# EAGLE design KGGR_M4 (EAGLE 9.4.2)
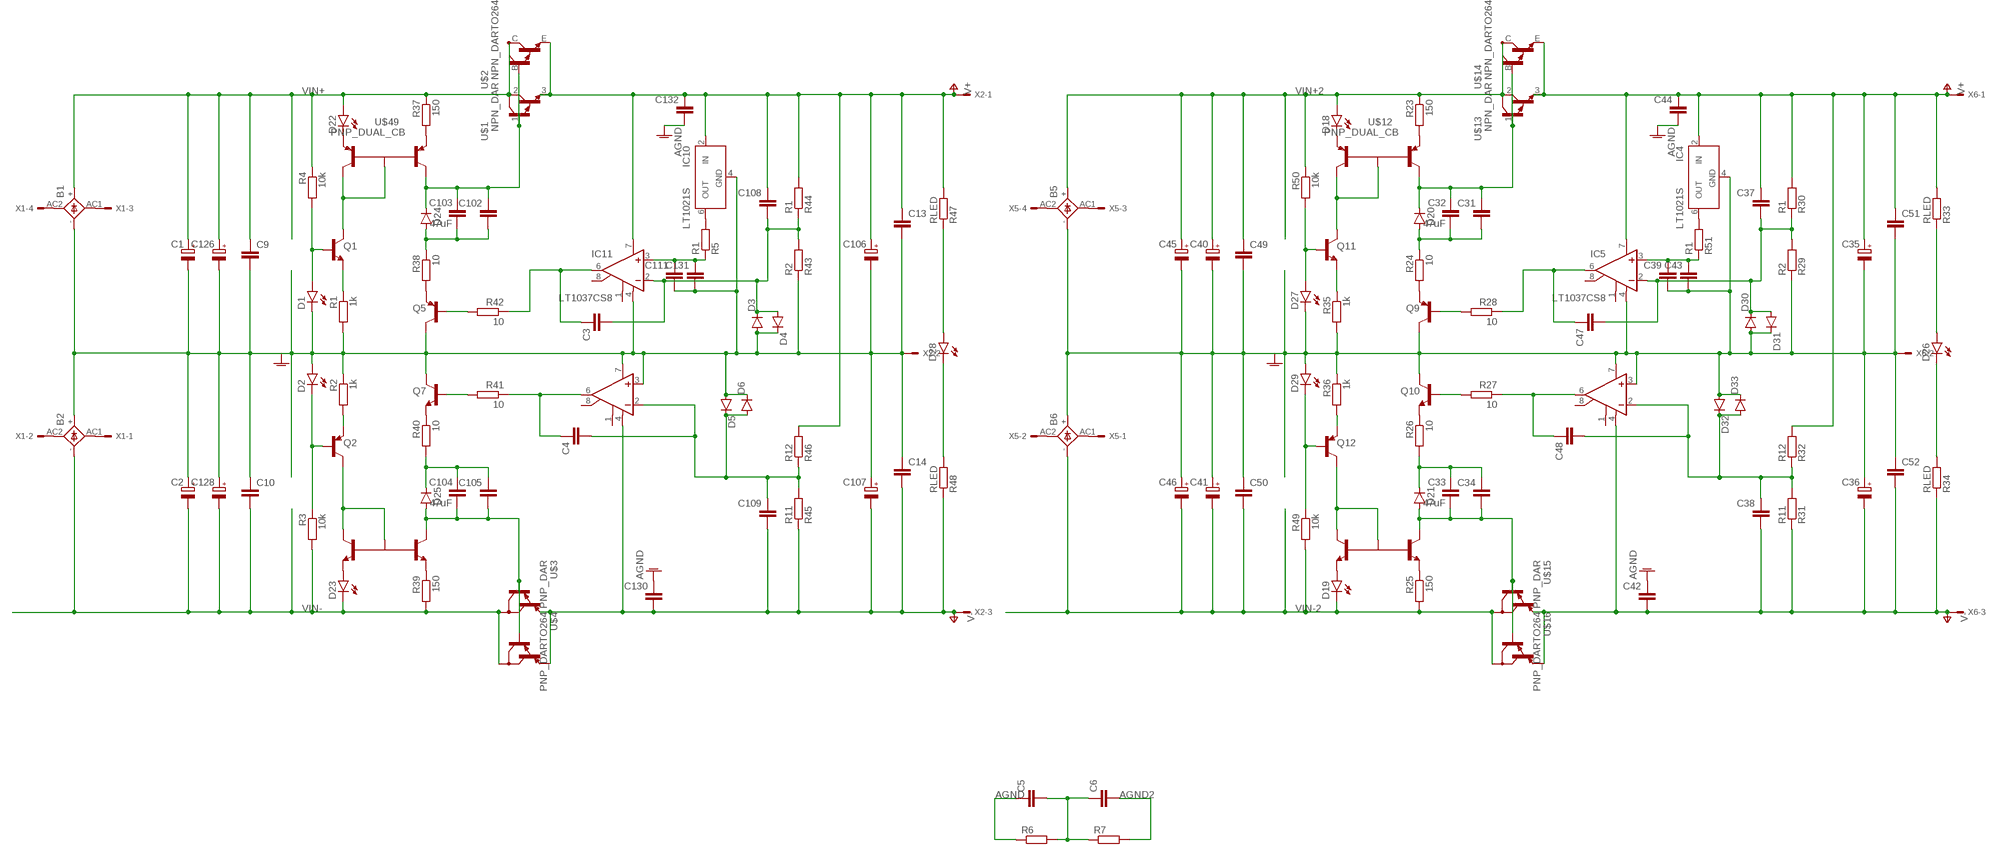
[diagram p0: schematic, sheet 1]

## Parts
B1  GBU4  [GBU4S]
B2  GBU4  [GBU4S]
B5  GBU4  [GBU4S]
B6  GBU4  [GBU4S]
C1  CPOL-EUE7.5-18  [E7,5-18]
C2  CPOL-EUE7.5-18  [E7,5-18]
C3  C-EUC0805  [C0805]
C4  C-EUC0805  [C0805]
C5  C-EU075-042X103  [C075-042X103]
C6  C-EU075-042X103  [C075-042X103]
C9  C-EU050-050X075  [C050-050X075]
C10  C-EU050-050X075  [C050-050X075]
C13  C-EU050-050X075  [C050-050X075]
C14  C-EU050-050X075  [C050-050X075]
C31  C-EUC0805  [C0805]
C32  47uF  C-EUC1206  [C1206]
C33  47uF  C-EUC1206  [C1206]
C34  C-EUC0805  [C0805]
C35  CPOL-EUE5-10.5  [E5-10,5]
C36  CPOL-EUE5-10.5  [E5-10,5]
C37  C-EUC0805  [C0805]
C38  C-EUC0805  [C0805]
C39  C-EUC0805  [C0805]
C40  CPOL-EUE7.5-18  [E7,5-18]
C41  CPOL-EUE7.5-18  [E7,5-18]
C42  C-EUC0805  [C0805]
C43  C-EUC1206  [C1206]
C44  C-EUC0805  [C0805]
C45  CPOL-EUE7.5-18  [E7,5-18]
C46  CPOL-EUE7.5-18  [E7,5-18]
C47  C-EUC0805  [C0805]
C48  C-EUC0805  [C0805]
C49  C-EU050-050X075  [C050-050X075]
C50  C-EU050-050X075  [C050-050X075]
C51  C-EU050-050X075  [C050-050X075]
C52  C-EU050-050X075  [C050-050X075]
C102  C-EUC0805  [C0805]
C103  47uF  C-EUC1206  [C1206]
C104  47uF  C-EUC1206  [C1206]
C105  C-EUC0805  [C0805]
C106  CPOL-EUE5-10.5  [E5-10,5]
C107  CPOL-EUE5-10.5  [E5-10,5]
C108  C-EUC0805  [C0805]
C109  C-EUC0805  [C0805]
C111  C-EUC0805  [C0805]
C126  CPOL-EUE7.5-18  [E7,5-18]
C128  CPOL-EUE7.5-18  [E7,5-18]
C130  C-EUC0805  [C0805]
C131  C-EUC1206  [C1206]
C132  C-EUC0805  [C0805]
D1  LEDVWV1206  [LED_SML1206]
D2  LEDVWV1206  [LED_SML1206]
D3  DIODE-SOD80C  [SOD80C]
D4  DIODE-SOD80C  [SOD80C]
D5  DIODE-SOD80C  [SOD80C]
D6  DIODE-SOD80C  [SOD80C]
D18  LEDVWV1206  [LED_SML1206]
D19  LEDVWV1206  [LED_SML1206]
D20  TZMC10  DIODE-SOD80C  [SOD80C]
D21  TZAMC10  DIODE-SOD80C  [SOD80C]
D22  LEDVWV1206  [LED_SML1206]
D23  LEDVWV1206  [LED_SML1206]
D24  TZMC10  DIODE-SOD80C  [SOD80C]
D25  TZAMC10  DIODE-SOD80C  [SOD80C]
D26  LEDVWV1206  [LED_SML1206]
D27  LEDVWV1206  [LED_SML1206]
D28  LEDVWV1206  [LED_SML1206]
D29  LEDVWV1206  [LED_SML1206]
D30  DIODE-SOD80C  [SOD80C]
D31  DIODE-SOD80C  [SOD80C]
D32  DIODE-SOD80C  [SOD80C]
D33  DIODE-SOD80C  [SOD80C]
IC4  LT1021S  [SOIC8]
IC5  LT1037CS8  [SOIC8]
IC6  LT1037CS8  [SOIC8]
IC10  LT1021S  [SOIC8]
IC11  LT1037CS8  [SOIC8]
IC12  LT1037CS8  [SOIC8]
Q1  TRANSISTOR_BC847CLT1-NPN-SOT23-BEC  [TRANSISTOR_SOT23-BEC]
Q2  TRANSISTOR_BC857C-PNP-SOT23-BEC  [TRANSISTOR_SOT23-BEC]
Q5  TRANSISTOR_BC857C-PNP-SOT23-BEC  [TRANSISTOR_SOT23-BEC]
Q7  TRANSISTOR_BC847CLT1-NPN-SOT23-BEC  [TRANSISTOR_SOT23-BEC]
Q9  TRANSISTOR_BC857C-PNP-SOT23-BEC  [TRANSISTOR_SOT23-BEC]
Q10  TRANSISTOR_BC847CLT1-NPN-SOT23-BEC  [TRANSISTOR_SOT23-BEC]
Q11  TRANSISTOR_BC847CLT1-NPN-SOT23-BEC  [TRANSISTOR_SOT23-BEC]
Q12  TRANSISTOR_BC857C-PNP-SOT23-BEC  [TRANSISTOR_SOT23-BEC]
R1  1k  R-EU_MELF0204W  [MINI_MELF-0204W]
R2  1k  R-EU_MELF0204W  [MINI_MELF-0204W]
R3  10k  R-EU_MELF0204W  [MINI_MELF-0204W]
R4  10k  R-EU_MELF0204W  [MINI_MELF-0204W]
R5  R1  R-EU_MELF0204W  [MINI_MELF-0204W]
R6  R-EU_R2512  [R2512]
R7  R-EU_R2512  [R2512]
R23  150  R-EU_MELF0204W  [MINI_MELF-0204W]
R24  10  R-EU_MELF0204W  [MINI_MELF-0204W]
R25  150  R-EU_MELF0204W  [MINI_MELF-0204W]
R26  10  R-EU_MELF0204W  [MINI_MELF-0204W]
R27  10  R-EU_MELF0204W  [MINI_MELF-0204W]
R28  10  R-EU_MELF0204W  [MINI_MELF-0204W]
R29  R2  R-EU_MELF0204W  [MINI_MELF-0204W]
R30  R1  R-EU_MELF0204W  [MINI_MELF-0204W]
R31  R11  R-EU_MELF0204W  [MINI_MELF-0204W]
R32  R12  R-EU_MELF0204W  [MINI_MELF-0204W]
R33  RLED  R-EU_MELF0204W  [MINI_MELF-0204W]
R34  RLED  R-EU_MELF0204W  [MINI_MELF-0204W]
R35  1k  R-EU_MELF0204W  [MINI_MELF-0204W]
R36  1k  R-EU_MELF0204W  [MINI_MELF-0204W]
R37  150  R-EU_MELF0204W  [MINI_MELF-0204W]
R38  10  R-EU_MELF0204W  [MINI_MELF-0204W]
R39  150  R-EU_MELF0204W  [MINI_MELF-0204W]
R40  10  R-EU_MELF0204W  [MINI_MELF-0204W]
R41  10  R-EU_MELF0204W  [MINI_MELF-0204W]
R42  10  R-EU_MELF0204W  [MINI_MELF-0204W]
R43  R2  R-EU_MELF0204W  [MINI_MELF-0204W]
R44  R1  R-EU_MELF0204W  [MINI_MELF-0204W]
R45  R11  R-EU_MELF0204W  [MINI_MELF-0204W]
R46  R12  R-EU_MELF0204W  [MINI_MELF-0204W]
R47  RLED  R-EU_MELF0204W  [MINI_MELF-0204W]
R48  RLED  R-EU_MELF0204W  [MINI_MELF-0204W]
R49  10k  R-EU_MELF0204W  [MINI_MELF-0204W]
R50  10k  R-EU_MELF0204W  [MINI_MELF-0204W]
R51  R1  R-EU_MELF0204W  [MINI_MELF-0204W]
U$1  NPN_DAR  [TRANSISTOR_TO220KG]
U$2  NPN_DARTO264  [TO264_TO-264]
U$3  PNP_DAR  [TRANSISTOR_TO220KG]
U$4  PNP_DARTO264  [TO264_TO-264]
U$11  NPN_DUAL_CBSOT-25-5  [SOT25]
U$12  PNP_DUAL_CB  [SOT25]
U$13  NPN_DAR  [TRANSISTOR_TO220KG]
U$14  NPN_DARTO264  [TO264_TO-264]
U$15  PNP_DAR  [TRANSISTOR_TO220KG]
U$16  PNP_DARTO264  [TO264_TO-264]
U$48  NPN_DUAL_CBSOT-25-5  [SOT25]
U$49  PNP_DUAL_CB  [SOT25]
X1  KK-156-4  [KK-156-4]
X2  KK-156-3  [KK-156-3]
X5  KK-156-4  [KK-156-4]
X6  KK-156-3  [KK-156-3]

## Nets
AGND: B1.- B2.+ C1.- C2.+ C5.1 C9.2 C10.1 C13.2 C14.1 C106.- C107.+ C111.2 C126.- C128.+ C130.1 C131.2 C132.2 D1.C D2.A D3.A D4.C D5.A D6.C IC10.4(GND) IC11.4(V-) IC12.3(+IN) IC12.7(V+) Q5.C Q7.C R1.2 R2.1 R6.1 R43.1 X2.2
AGND2: B5.- B6.+ C6.2 C35.- C36.+ C39.2 C40.- C41.+ C42.1 C43.2 C44.2 C45.- C46.+ C49.2 C50.1 C51.2 C52.1 D27.C D29.A D30.A D31.C D32.A D33.C IC4.4(GND) IC5.4(V-) IC6.3(+IN) IC6.7(V+) Q9.C Q10.C R7.2 R29.1 R35.2 R36.1 X6.2 ; supply symbol labelled AGND
N$1: B1.AC2(AC1) X1.4
N$2: B1.AC1(AC2) X1.3
N$3: B2.AC2(AC1) X1.2
N$4: B2.AC1(AC2) X1.1
N$6: C5.2 C6.1 R6.2 R7.1
N$9: Q1.E R1.1
N$10: D1.A Q1.B R4.2
N$12: Q2.E R2.2
N$13: D2.C Q2.B R3.1
N$14: IC10.6(OUT) R5.2
N$50: Q11.C U$12.2(B) U$12.5(C1)
N$51: C31.1 C32.1 D20.C U$12.4(C2) U$13.1(B) U$14.B
N$52: C31.2 C32.2 D20.A R24.1
N$53: Q9.E R24.2
N$54: Q10.E R26.1
N$55: C33.1 C34.1 D21.C R26.2
N$56: C33.2 C34.2 D21.A U$11.4(C2) U$15.1(B) U$16.B
N$57: Q12.C U$11.2(B) U$11.5(C1)
N$58: Q10.B R27.2
N$59: Q9.B R28.2
N$60: C37.2 C47.2 D30.C D31.A IC5.2(-IN) R29.2 R30.1
N$61: D26.C R34.2
N$62: D26.A R33.1
N$63: C48.1 IC6.6(OUT) R27.1
N$64: C38.1 C48.2 D32.C D33.A IC6.2(-IN) R31.2 R32.1
N$65: C39.1 C43.1 IC5.3(+IN) R51.1
N$66: C47.1 IC5.6(OUT) R28.1
N$68: R25.1 U$11.3(E2)
N$69: D19.A U$11.1(E1)
N$71: R23.2 U$12.3(E2)
N$72: D18.C U$12.1(E1)
N$73: B5.AC2(AC1) X5.4
N$74: B5.AC1(AC2) X5.3
N$75: B6.AC2(AC1) X5.2
N$76: B6.AC1(AC2) X5.1
N$77: Q11.E R35.1
N$78: D27.A Q11.B R50.2
N$79: Q12.E R36.2
N$80: D29.C Q12.B R49.1
N$81: IC4.6(OUT) R51.2
N$96: Q1.C U$49.2(B) U$49.5(C1)
N$97: C102.1 C103.1 D24.C U$1.1(B) U$2.B U$49.4(C2)
N$98: C102.2 C103.2 D24.A R38.1
N$99: Q5.E R38.2
N$100: Q7.E R40.1
N$101: C104.1 C105.1 D25.C R40.2
N$102: C104.2 C105.2 D25.A U$3.1(B) U$4.B U$48.4(C2)
N$103: Q2.C U$48.2(B) U$48.5(C1)
N$104: Q7.B R41.2
N$105: Q5.B R42.2
N$106: C3.2 C108.2 D3.C D4.A IC11.2(-IN) R43.2 R44.1
N$107: D28.C R48.2
N$108: D28.A R47.1
N$109: C4.1 IC12.6(OUT) R41.1
N$110: C4.2 C109.1 D5.C D6.A IC12.2(-IN) R45.2 R46.1
N$111: C111.1 C131.1 IC11.3(+IN) R5.1
N$112: C3.1 IC11.6(OUT) R42.1
N$113: R39.1 U$48.3(E2)
N$114: D23.A U$48.1(E1)
N$115: R37.2 U$49.3(E2)
N$116: D22.C U$49.1(E1)
V+: C13.1 C106.+ C108.1 C132.1 IC10.2(IN) IC11.7(V+) R44.2 R46.2 R47.2 U$1.3(E) U$2.E X2.1
V+2: C35.+ C37.1 C44.1 C51.1 IC4.2(IN) IC5.7(V+) R30.2 R32.2 R33.2 U$13.3(E) U$14.E X6.1 ; supply symbol labelled V+
V-: C14.2 C107.- C109.2 C130.2 IC12.4(V-) R45.1 R48.1 U$3.3(E) U$4.E X2.3
V-2: C36.- C38.2 C42.2 C52.2 IC6.4(V-) R31.1 R34.1 U$15.3(E) U$16.E X6.3 ; supply symbol labelled V-
VIN+: B1.+ C1.+ C9.1 C126.+ D22.A R4.1 R37.1 U$1.2(C) U$2.C
VIN+2: B5.+ C40.+ C45.+ C49.1 D18.A R23.1 R50.1 U$13.2(C) U$14.C
VIN-: B2.- C2.- C10.2 C128.- D23.C R3.2 R39.2 U$3.2(C) U$4.C
VIN-2: B6.- C41.- C46.- C50.2 D19.C R25.2 R49.2 U$15.2(C) U$16.C
Unconnected: IC5.1(CMP1) IC5.8(CMP2) IC6.1(CMP1) IC6.8(CMP2) IC11.1(CMP1) IC11.8(CMP2) IC12.1(CMP1) IC12.8(CMP2)

## Library data of the parts
B1 B2 B5 B6 = Vwvwbg:GBU4: GENERAL INSTRUMENT RECTIFIER
C1 C2 C35 C36 C40 C41 C45 C46 C106 C107 C126 C128 = Vwvwbg:CPOL-EU: POLARIZED CAPACITOR, European symbol
C3-C6 C9 C10 C13 C14 C31-C34 C37-C39 C42-C44 C47-C52 C102-C105 C108 C109 C111 C130-C132 = Vwvwbg:C-EU: CAPACITOR, European symbol
D1 D2 D18 D19 D22 D23 D26-D29 = Vwvwbg:LED: LED OSRAM: - CHIPLED LG R971, LG N971, LY N971, LG Q971, LY Q971, LO R971, LY R971 LH N974, LH R974 LS Q976, LO Q976, LY Q976 LO Q996 - Hyper CHIPLED LW Q18S LB Q993, LB Q99A, LB R99A - SideLED LS A670, LO A670, LY A670, LG A670, LP A670 LB A673, LV A673, LT A673, LW A673 LH A674 LY A675 LS A676, LA A676, LO A676, LY A676, LW A676 LS A679, LY A679, LG A679 - Hyper Micro SIDELED® LS Y876, LA Y876, LO Y876, LY Y876 LT Y87S - SmartLED LW L88C, LW L88S LB L89C, LB L89S, LG L890 LS L89K, LO L89K, LY L89K LS L896, LA L896, LO L896, LY L896 - TOPLED LS T670, LO T670, LY T670, LG T670, LP T670 LSG T670, LSP T670, LSY T670, LOP T670, LYG T670 LG T671, LOG T671, LSG T671 LB T673, LV T673, LT T673, LW T673 LH T674 LS T676, LA T676, LO T676, LY T676, LB T676, LH T676, LSB T676, LW T676 LB T67C, LV T67C, LT T67C, LS T67K, LO T67K, LY T67K, LW E67C LS E67B, LA E67B, LO E67B, LY E67B, LB E67C, LV E67C, LT E67C LW T67C LS T679, LY T679, LG T679 LS T770, LO T770, LY T770, LG T770, LP T770 LB T773, LV T773, LT T773, LW T773 LH T774 LS E675, LA E675, LY E675, LS T675 LS T776, LA T776, LO T776, LY T776, LB T776 LHGB T686 LT T68C, LB T68C - Hyper Mini TOPLED® LB M676 - Mini TOPLED Santana® LG M470 LS M47K, LO M47K, LY M47K Source: http://www.osram.convergy.de LUXEON: - LUMILED® LXK2-PW12-R00, LXK2-PW12-S00, LXK2-PW14-U00, LXK2-PW14-V00 LXK2-PM12-R00, LXK2-PM12-S00, LXK2-PM14-U00 LXK2-PE12-Q00, LXK2-PE12-R00, LXK2-PE12-S00, LXK2-PE14-T00, LXK2-PE14-U00 LXK2-PB12-K00, LXK2-PB12-L00, LXK2-PB12-M00, LXK2-PB14-N00, LXK2-PB14-P00, LXK2-PB14-Q00 LXK2-PR12-L00, LXK2-PR12-M00, LXK2-PR14-Q00, LXK2-PR14-R00 LXK2-PD12-Q00, LXK2-PD12-R00, LXK2-PD12-S00 LXK2-PH12-R00, LXK2-PH12-S00 LXK2-PL12-P00, LXK2-PL12-Q00, LXK2-PL12-R00 Source: www.luxeon.com KINGBRIGHT: KA-3528ASYC Source: www.kingbright.com
D3-D6 D20 D21 D24 D25 D30-D33 = Vwvwbg:DIODE-: DIODE
IC4 IC10 = Vwvwbg:LT1021: Precision Reference Source: http://www.linear.com/pc/downloadDocument.do?navId=H0,C1,C1010,C1603,P1229,D2805; MPN: LT1021DCS8-10#PBF; OC_FARNELL: 1273428; OC_NEWARK: 57M0993
IC5 IC6 IC11 IC12 = Vwvwbg:LT10*: Low Noise, High Speed, Precision Operational Amplifiers Source: http://www.linear.com/pc/downloadDocument.do?navId=H0,C1,C1154,C1009,C1026,P1212,D2204
Q1 Q7 Q10 Q11 = Vwvwbg:TRANSISTOR_*-NPN-: NPN Transistror BF959 corrected 2008.03.06
Q2 Q5 Q9 Q12 = Vwvwbg:TRANSISTOR_*-PNP-: PNP Transistror
R1-R7 R23-R51 = Vwvwbg:R-EU_: RESISTOR, European symbol
U$1 U$2 U$13 U$14 = Vwvwbg:NPN_DAR
U$3 U$4 U$15 U$16 = Vwvwbg:PNP_DAR
U$11 U$48 = Vwvwbg:NPN_DUAL_CB
U$12 U$49 = Vwvwbg:PNP_DUAL_CB
X1 X5 = Vwvwbg:KK-156-4: KK 156 HEADER Source: http://www.molex.com/pdm_docs/sd/026604100_sd.pdf; MF: MOLEX; OC_FARNELL: unknown; OC_NEWARK: unknown
X2 X6 = Vwvwbg:KK-156-3: KK 156 HEADER Source: http://www.molex.com/pdm_docs/sd/026604100_sd.pdf; MF: MOLEX; OC_FARNELL: unknown; OC_NEWARK: unknown

## Board
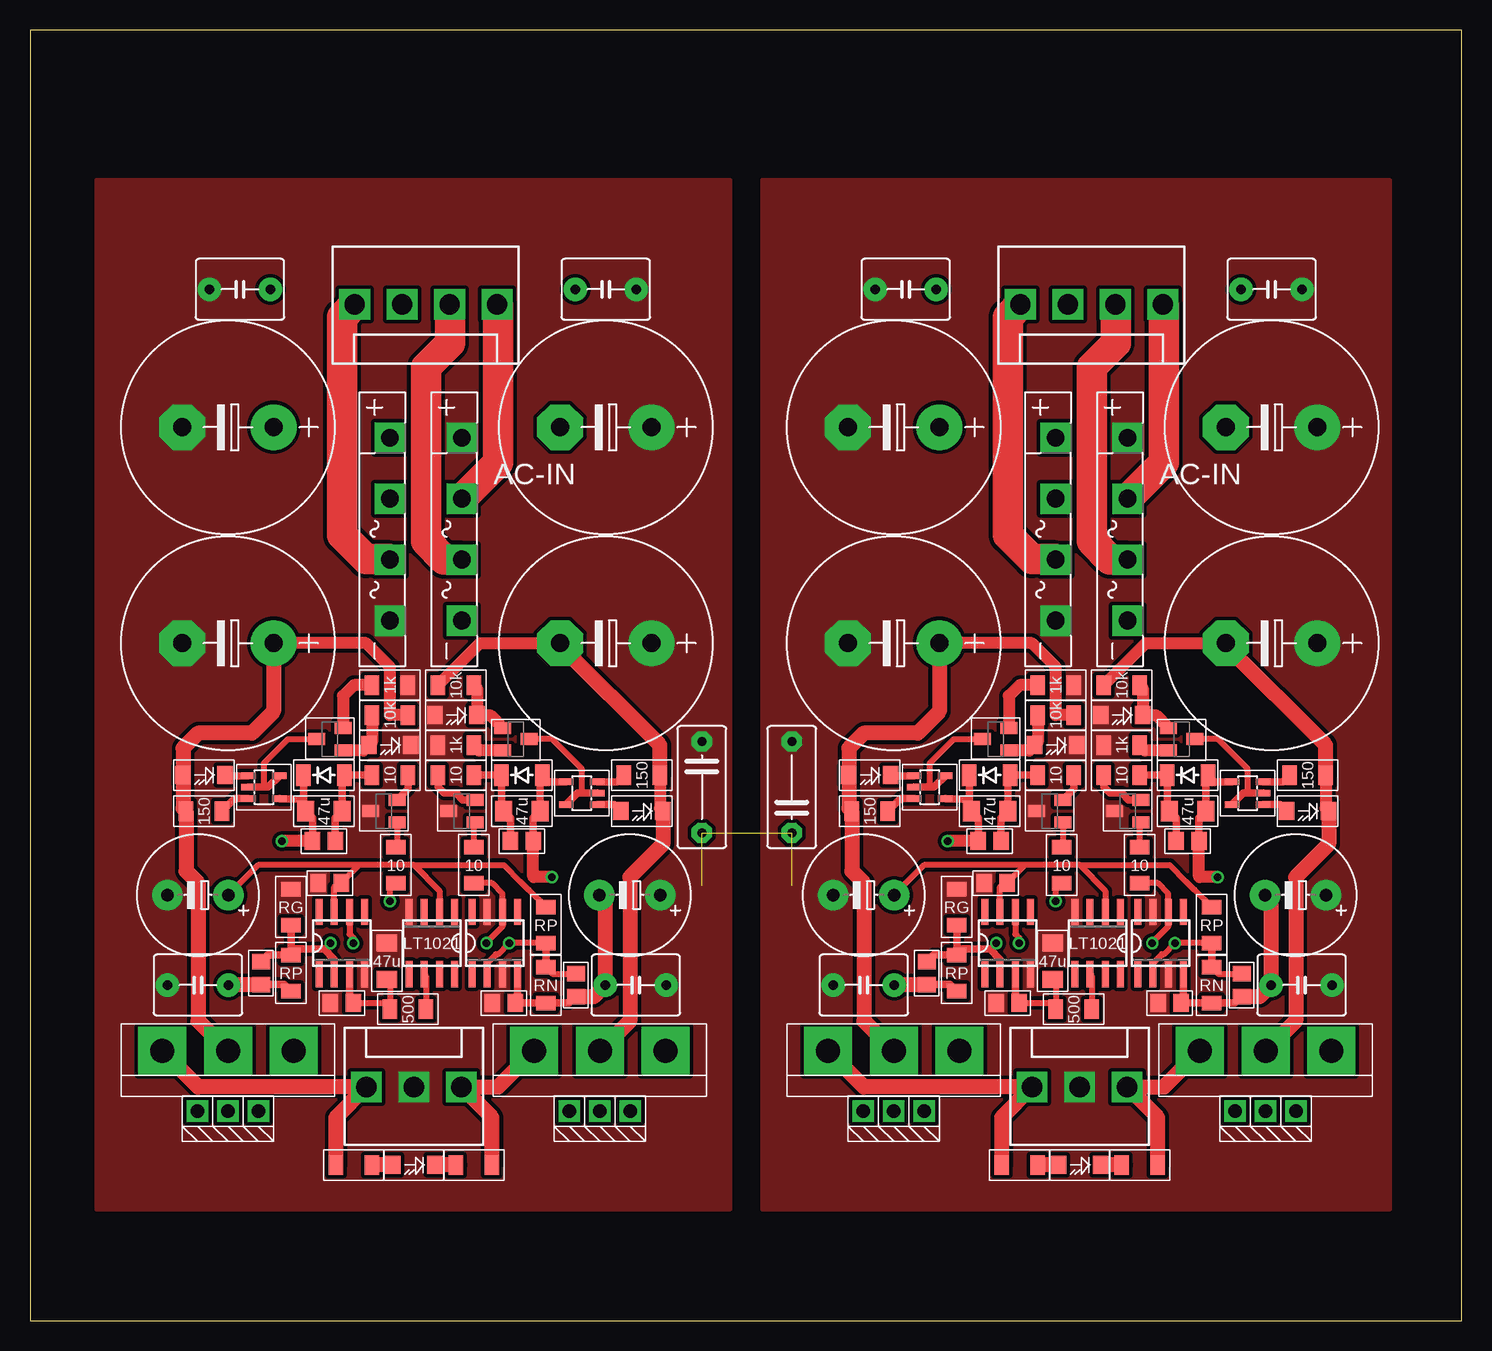
[diagram p1: board, top side]
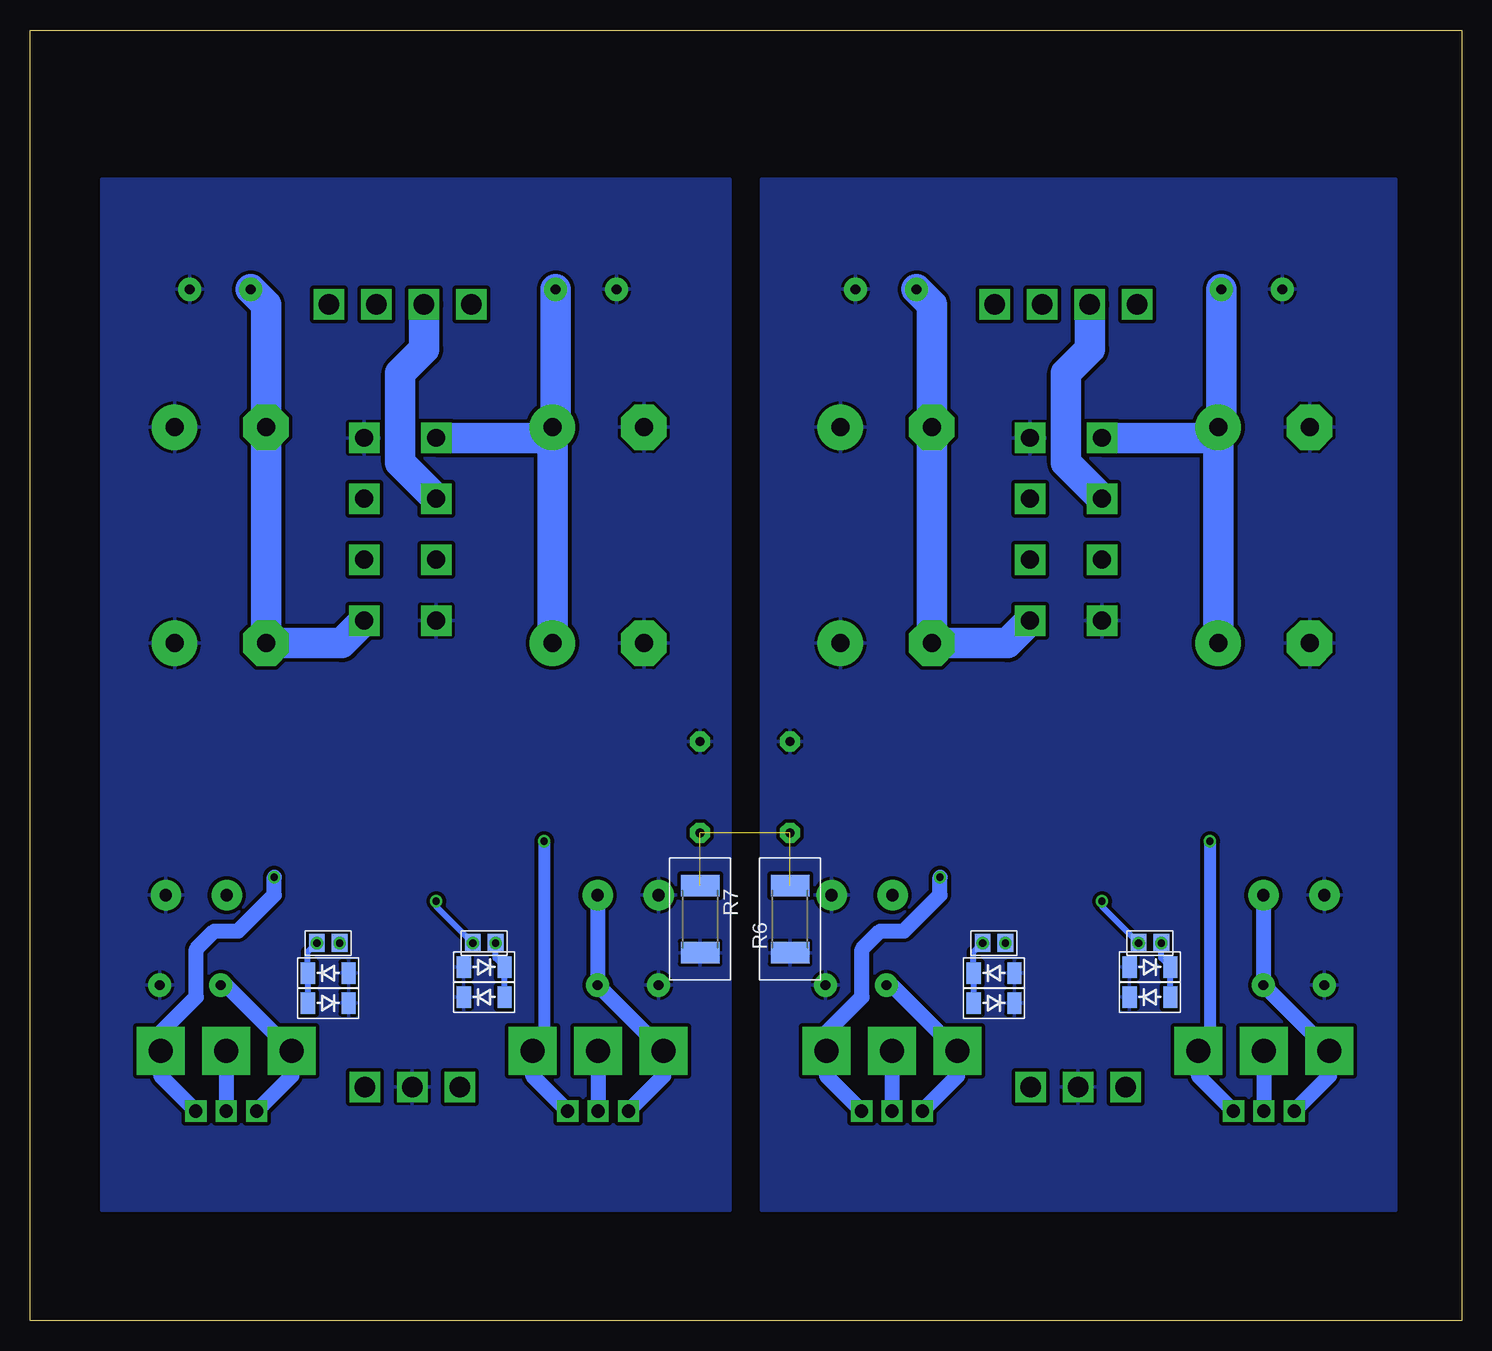
[diagram p2: board, bottom side, seen from below]

Size 119.36 x 107.62 mm. Coordinates in mm from the lower left corner, seen from the top.
Outline: 0,0 119.36,0 119.36,107.62 0,107.62 0,0
Copper layers (1*16): Top 0.035mm / dielectric 1.5mm / Bottom 0.035mm
Design rules "default *": minimum track width 10mil, minimum drill 24mil, track to track 12mil, track to pad 12mil, pad to pad 8mil, via to via 8mil, smd to smd 8mil, copper to edge 20mil, drill to drill 8mil, minimum pad ring 10mil, minimum via ring 8mil, stop-mask expansion 4mil, vias tented up to drill 0mil, thermal gap 10mil

### Footprints (pad centres in the part's own frame; a part is rotated, then mirrored left to right if it is on the bottom)
GBU4S = drill 1.499 pad 2.54 square: + 7.62,0; - -7.62,0; AC1 2.54,0; AC2 -2.54,0
E7,5-18 = drill 1.5 pad 3.81: + -3.81,0 | drill 1.5 pad 3.81 octagon: - 3.81,0
C0805 = smd 1.3 x 1.5: 1 -0.95,0; 2 0.95,0
C075-042X103 = drill 0.75 pad 1.676 octagon: 1 -3.81,0; 2 3.81,0
C050-050X075 = drill 0.813 pad 1.93: 1 -2.54,0; 2 2.54,0
C1206 = smd 1.4 x 1.7: 1 -1.527,0; 2 1.527,0
E5-10,5 = drill 1.016 pad 2.54: + -2.54,0; - 2.54,0
LED_SML1206 = smd 1.3 x 1.5: A 1.75,0; C -1.75,0
SOD80C = smd 1.2 x 1.8: A 1.7,0; C -1.7,0
SOIC8 = smd 0.6 x 2.2: 1 -1.905,-2.6; 2 -0.635,-2.6; 3 0.635,-2.6; 4 1.905,-2.6; 5 1.905,2.6; 6 0.635,2.6; 7 -0.635,2.6; 8 -1.905,2.6
TRANSISTOR_SOT23-BEC = smd 1 x 1.4: B -0.95,-1.1; C 0,1.1; E 0.95,-1.1
MINI_MELF-0204W = smd 1.2 x 1.6: 1 -1.5,0; 2 1.5,0
R2512 = smd 1.8 x 3.2: 1 -2.8,0; 2 2.8,0
TRANSISTOR_TO220KG = drill 1.1 pad 1.778 square: 1 -2.54,0; 2 0,0; 3 2.54,0
TO264_TO-264 = drill 2 pad 4 square: B -5.461,0; C 0,0; E 5.461,0
SOT25 = smd 0.55 x 1.2: 1 -0.95,-1.3; 2 0,-1.3; 3 0.95,-1.3; 4 0.95,1.3; 5 -0.95,1.3
KK-156-4 = drill 1.7 pad 2.54 square: 1 -5.94,0; 2 -1.98,0; 3 1.98,0; 4 5.94,0
KK-156-3 = drill 1.7 pad 2.54 square: 1 -3.96,0; 2 0,0; 3 3.96,0

### Placement (x,y rotation side)
B1  30,66 90 top
B2  36,66 90 top
B5  85.5,66 90 top
B6  91.5,66 90 top
C1  16.5,56.5 180 top
C2  48,56.5 180 top
C3  26,31.5 0 bottom
C4  39,31.5 180 bottom
C5  56,44.5 270 top
C6  63.5,44.5 90 top
C9  17.5,86 180 top
C10  48,86 180 top
C13  14,28 180 top
C14  50.5,28 180 top
C31  80,40 0 top
C32  80,42.5 0 top
C33  96.5,42.5 0 top
C34  96.5,40 0 top
C35  69.5,35.5 180 top
C36  105.5,35.5 180 top
C37  74.75,29 90 top
C38  101,28 270 top
C39  81.5,26.5 180 top
C40  72,74.5 180 top
C41  103.5,74.5 180 top
C42  95,26.5 0 top
C43  85.25,30 90 top
C44  80.5,36.5 180 top
C45  72,56.5 180 top
C46  103.5,56.5 180 top
C47  81.5,31.5 0 bottom
C48  94.5,31.5 180 bottom
C49  73,86 180 top
C50  103.5,86 180 top
C51  69.5,28 180 top
C52  106,28 180 top
C102  24.5,40 0 top
C103  24.5,42.5 0 top
C104  41,42.5 0 top
C105  41,40 0 top
C106  14,35.5 180 top
C107  50,35.5 180 top
C108  19.25,29 90 top
C109  45.5,28 270 top
C111  26,26.5 180 top
C126  16.5,74.5 180 top
C128  48,74.5 180 top
C130  39.5,26.5 0 top
C131  29.75,30 90 top
C132  25,36.5 180 top
D1  30,48 180 top
D2  35.5,50.5 180 top
D3  26,29.5 180 bottom
D4  26,27 0 bottom
D5  39,29 0 bottom
D6  39,26.5 180 bottom
D18  70,45.5 180 top
D19  106.5,42.5 180 top
D20  80,45.5 0 top
D21  96.5,45.5 0 top
D22  14.5,45.5 180 top
D23  51,42.5 180 top
D24  24.5,45.5 0 top
D25  41,45.5 0 top
D26  87.5,13 180 top
D27  85.5,48 180 top
D28  32,13 180 top
D29  91,50.5 180 top
D30  81.5,29.5 180 bottom
D31  81.5,27 0 bottom
D32  94.5,29 0 bottom
D33  94.5,26.5 180 bottom
IC4  89,31.5 180 top
IC5  81.5,31.5 0 top
IC6  94.25,31.5 0 top
IC10  33.5,31.5 180 top
IC11  26,31.5 0 top
IC12  38.75,31.5 0 top
Q1  25,48.5 90 top
Q2  40.5,48.5 270 top
Q5  29.5,42.5 90 top
Q7  36,42.5 90 top
Q9  85,42.5 90 top
Q10  91.5,42.5 90 top
Q11  80.5,48.5 90 top
Q12  96,48.5 270 top
R1  30,53 0 top
R2  35.5,48 0 top
R3  35.5,53 180 top
R4  30,50.5 180 top
R5  31.5,26 0 top
R6  56,33.5 90 bottom
R7  63.5,33.5 270 bottom
R23  70,42.5 0 top
R24  85.5,45.5 0 top
R25  106.5,45.5 0 top
R26  91,45.5 0 top
R27  92.5,38 90 top
R28  86,38 90 top
R29  77.25,34.5 270 top
R30  77.25,29 270 top
R31  98.5,28 90 top
R32  98.5,33 90 top
R33  82.5,13 180 top
R34  92.5,13 180 top
R35  85.5,53 0 top
R36  91,48 0 top
R37  14.5,42.5 0 top
R38  30,45.5 0 top
R39  51,45.5 0 top
R40  35.5,45.5 0 top
R41  37,38 90 top
R42  30.5,38 90 top
R43  21.75,34.5 270 top
R44  21.75,29 270 top
R45  43,28 90 top
R46  43,33 90 top
R47  27,13 180 top
R48  37,13 180 top
R49  91,53 180 top
R50  85.5,50.5 180 top
R51  87,26 0 top
U$1  16.5,17.5 180 top
U$2  16.5,22.5 180 top
U$3  47.5,17.5 180 top
U$4  47.5,22.5 180 top
U$11  101.5,44 90 top
U$12  75,44.5 270 top
U$13  72,17.5 180 top
U$14  72,22.5 180 top
U$15  103,17.5 180 top
U$16  103,22.5 180 top
U$48  46,44 90 top
U$49  19.5,44.5 270 top
X1  33,84.75 180 top
X2  32,19.5 0 top
X5  88.5,84.75 180 top
X6  87.5,19.5 0 top

### Tracks (layer width: path | path; a pad name or v marks a point on that pad's centre or on a via)
AGND
  pour Top (no thermals): 5.5,95.18 58.38,95.18 58.38,9.23 5.5,9.23
  pour Bottom: 5.5,9.23 5.5,95.18 58.38,95.18 58.38,9.23
AGND2
  pour Top (no thermals): 61,95.18 113.38,95.18 113.38,9.23 61,9.23
  pour Bottom: 61,9.23 61,95.18 113.38,95.18 113.38,9.23
N$1
  Top 2.54: B1.AC2 29.96,63.5 28,63.5 26,65.5 26,83.69 X1.4
N$2
  Bottom 2.54: B1.AC1 33,71.54 33,79 31,81 31,84.73 X1.3
N$3
  Top 2.54: B2.AC2 34.54,63.46 33,65 33,79.5 35,81.5 35,84.73 X1.2
N$4
  Top 2.54: B2.AC1 39,71.54 39,84.69 X1.1
N$6  (3 unrouted)
N$9
  Top 1.016: R1.1 27,53 26.1,52.1 Q1.E
N$10
  Top 1.016: R4.2 28.5,48.25 D1.A 27.8,47.55 Q1.B
N$12
  Top 1.016: Q2.E 37.45,47.55 R2.2
N$13
  Top 1.016: R3.1 37.25,52.75 D2.C 38.35,50.5 Q2.B
N$14
  Top 0.508: IC10.6 33,28.77 R5.2
N$50
  Top 0.508: 75,44.5 75,46.5 77,48.5 Q11.C
  Top 0.61: U$12.5 75.35,44.5 75,44.5 U$12.2
N$51  (via drill 0.61)
  Top 0.61: C31.1 79.05,41.92 C32.1 78.3,42.67 78.3,43.5 | D20.C 78.3,43.5 | U$12.4 76.35,43.5 78.3,43.5
  Top 1.016: C31.1 v76.5,40
  Bottom 1.016: v76.5,40 76.5,23.46 U$14.B
  Bottom 1.27: U$13.1 77.46,20.42 U$14.B
N$52
  Top 0.61: R24.1 D20.A 81.53,45.33 C32.2 80.95,41.92 C31.2
N$53
  Top 0.61: R24.2 87,44.35 Q9.E
N$54
  Top 0.61: Q10.E 91.55,43.45 91,44 90,44 89.5,44.5 R26.1
N$55
  Top 0.61: R26.2 D21.C 94.8,42.67 C33.1 95.55,41.92 C34.1
N$56  (via drill 0.61)
  Top 0.61: C34.2 97.45,41.92 C33.2 98.03,45.33 D21.A 98.75,44.95 U$11.4
  Top 1.016: v99,37 97.5,37 97.45,37.05 C34.2
  Bottom 1.27: U$15.1 108.46,20.42 U$16.B 108.46,24.04 105.5,27 105.5,31 104,32.5 102,32.5 99,35.5 v99,37
N$57
  Top 0.508: 101.5,44 101.5,46 99,48.5 Q12.C
  Top 0.61: U$11.5 101.15,44 101.5,44 U$11.2
N$58
  Top 0.508: R27.2 92.5,41.45 Q10.B
N$59
  Top 0.508: Q9.B 86.1,39.6 R28.2
N$60  (via drill 0.61)
  Top 0.508: C47.2 80.05,31 80,31
  Top 0.61: 77.25,31 R30.1 75.3,30.5 C37.2 | 77.25,31 R29.2 | IC5.2 80.86,30.14 80,31 77.25,31
  Bottom 0.508: C47.2 80.55,30.25 D30.C D31.A
  other vias: 80.55,31.5
N$61
  Top 1.27: R34.2 D26.C
N$62
  Top 1.27: D26.A R33.1
N$63  (via drill 0.61)
  Top 0.508: 92.61,36.62 R27.1 94,36.5 94.89,35.62 IC6.6 94.89,32.88 93.5,31.5 C48.1
  other vias: 93.55,31.5
N$64  (via drill 0.61)
  Top 0.508: 98.27,31.27 R32.1 C48.2 94.51,30.56 94.35,30.56 93.61,29.82 IC6.2 | R31.2 99.05,28.95 C38.1
  Top 0.61: R32.1 R31.2
  Bottom 0.508: D33.A D32.C 96.2,30.75 C48.2
  other vias: 95.45,31.5
N$65
  Top 0.508: C39.1 85,26.5 R51.1 85.5,28.22 C43.1
  Top 0.61: IC5.3 82.14,26.82 C39.1
N$66  (via drill 0.61)
  Top 0.508: C47.1 82.45,31.95 82.14,32.27 IC5.6 | v85.5,35 85.5,36 R28.1
  Bottom 0.508: C47.1 85.5,34.55 v85.5,35
  other vias: 82.45,31.5
N$68
  Top 0.61: U$11.3 104.45,44.95 R25.1
N$69
  Top 0.61: U$11.1 104.2,43.05 D19.A
N$71
  Top 0.61: U$12.3 72.55,43.55 R23.2
N$72
  Top 0.61: U$12.1 71.8,45.45 D18.C
N$73
  Top 2.54: B5.AC2 85.46,63.5 83.5,63.5 81.5,65.5 81.5,83.69 X5.4
N$74
  Bottom 2.54: B5.AC1 88.5,71.54 88.5,79 86.5,81 86.5,84.73 X5.3
N$75
  Top 2.54: B6.AC2 90.04,63.46 88.5,65 88.5,79.5 90.5,81.5 90.5,84.73 X5.2
N$76
  Top 2.54: B6.AC1 94.5,71.54 94.5,84.69 X5.1
N$77
  Top 1.016: R35.1 82.5,53 81.6,52.1 Q11.E
N$78
  Top 1.016: R50.2 84,48.25 D27.A 83.3,47.55 Q11.B
N$79
  Top 1.016: Q12.E 92.95,47.55 R36.2
N$80
  Top 1.016: R49.1 92.75,52.75 D29.C 93.85,50.5 Q12.B
N$81
  Top 0.508: IC4.6 88.5,28.77 R51.2
N$96
  Top 0.508: 19.5,44.5 19.5,46.5 21.5,48.5 Q1.C
  Top 0.61: U$49.5 19.85,44.5 19.5,44.5 U$49.2
N$97  (via drill 0.61)
  Top 0.61: C102.1 23.55,41.92 C103.1 22.8,42.67 22.8,43.5 | D24.C 22.8,43.5 | U$49.4 20.85,43.5 22.8,43.5
  Top 1.016: C102.1 v21,40
  Bottom 1.016: v21,40 21,23.46 U$2.B
  Bottom 1.27: U$1.1 21.96,20.42 U$2.B
N$98
  Top 0.61: R38.1 D24.A 26.03,45.33 C103.2 25.45,41.92 C102.2
N$99
  Top 0.61: R38.2 31.5,44.35 Q5.E
N$100
  Top 0.61: Q7.E 36.05,43.45 35.5,44 34.5,44 34,44.5 R40.1
N$101
  Top 0.61: R40.2 D25.C 39.3,42.67 C104.1 40.05,41.92 C105.1
N$102  (via drill 0.61)
  Top 0.61: C105.2 41.95,41.92 C104.2 42.53,45.33 D25.A 43.25,44.95 U$48.4
  Top 1.016: v43.5,37 42,37 41.95,37.05 C105.2
  Bottom 1.27: U$3.1 52.96,20.42 U$4.B 52.96,24.04 50,27 50,31 48.5,32.5 46.5,32.5 43.5,35.5 v43.5,37
N$103
  Top 0.508: 46,44 46,46 43.5,48.5 Q2.C
  Top 0.61: U$48.5 45.65,44 46,44 U$48.2
N$104
  Top 0.508: R41.2 37,41.45 Q7.B
N$105
  Top 0.508: Q5.B 30.6,39.6 R42.2
N$106  (via drill 0.61)
  Top 0.508: C3.2 24.55,31 24.5,31
  Top 0.61: 21.75,31 R44.1 19.8,30.5 C108.2 | 21.75,31 R43.2 | IC11.2 25.36,30.14 24.5,31 21.75,31
  Bottom 0.508: C3.2 25.05,30.25 D3.C D4.A
  other vias: 25.05,31.5
N$107
  Top 1.27: R48.2 D28.C
N$108
  Top 1.27: D28.A R47.1
N$109  (via drill 0.61)
  Top 0.508: 37.12,36.62 R41.1 38.5,36.5 39.38,35.62 IC12.6 39.38,32.88 38,31.5 C4.1
  other vias: 38.05,31.5
N$110  (via drill 0.61)
  Top 0.508: 42.77,31.27 R46.1 C4.2 39.01,30.56 38.85,30.56 38.12,29.82 IC12.2 | R45.2 43.55,28.95 C109.1
  Top 0.61: R46.1 R45.2
  Bottom 0.508: D6.A D5.C 40.7,30.75 C4.2
  other vias: 39.95,31.5
N$111
  Top 0.508: C111.1 29.5,26.5 R5.1 30,28.22 C131.1
  Top 0.61: IC11.3 26.64,26.82 C111.1
N$112  (via drill 0.61)
  Top 0.508: C3.1 26.95,31.95 26.64,32.27 IC11.6 | v30,35 30,36 R42.1
  Bottom 0.508: C3.1 30,34.55 v30,35
  other vias: 26.95,31.5
N$113
  Top 0.61: U$48.3 48.95,44.95 R39.1
N$114
  Top 0.61: U$48.1 48.7,43.05 D23.A
N$115
  Top 0.61: U$49.3 17.05,43.55 R37.2
N$116
  Top 0.61: U$49.1 16.3,45.45 D22.C
V+
  Top 0.508: IC11.7 25.36,36.19 C132.1 27.45,38 | 32,38 34.13,35.87 IC10.2 | 32,38 27.45,38 | 32,38 39.5,38 40.88,36.62 40.88,36.61 41.56,35.93 41.57,35.93 R46.2 | C106.+ 19.04,38 27.45,38
  Top 0.61: C108.1 21.2,28.05 R44.2
  Top 1.27: C108.1 19.2,28 C13.1 | U$2.E 11.04,22.46 14,19.5 X2.1 25.5,16.96 R47.2
  Bottom 1.27: U$1.3 11.04,20.42 U$2.E C13.1 C106.+
V+2
  Top 0.508: IC5.7 80.86,36.19 C44.1 82.95,38 | 87.5,38 89.64,35.87 IC4.2 | 87.5,38 82.95,38 | 87.5,38 95,38 96.38,36.62 96.38,36.61 97.06,35.93 97.07,35.93 R32.2 | C35.+ 74.54,38 82.95,38
  Top 0.61: C37.1 76.7,28.05 R30.2
  Top 1.27: C37.1 74.7,28 C51.1 | U$14.E 66.54,22.46 69.5,19.5 X6.1 81,16.96 R33.2
  Bottom 1.27: U$13.3 66.54,20.42 U$14.E C51.1 C35.+
V-
  Top 0.61: IC12.4 40.66,26.7 C130.2 R45.1 44.95,26.5 C109.2
  Top 1.27: C109.2 47.01,27.05 C14.2 47.96,35 C107.- | U$4.E 39.04,19.5 X2.3 38.5,16.96 R48.1
  Bottom 1.27: C14.2 47.54,28 U$4.E 42.04,20.42 U$3.3
V-2
  Top 0.61: IC6.4 96.16,26.7 C42.2 R31.1 100.45,26.5 C38.2
  Top 1.27: C38.2 102.51,27.05 C52.2 103.46,35 C36.- | U$16.E 94.54,19.5 X6.3 94,16.96 R34.1
  Bottom 1.27: C52.2 103.04,28 U$16.E 97.54,20.42 U$15.3
VIN+
  Top 1.016: R4.1 30,50.5 30,54.5 28,56.5 C1.+
  Top 1.27: C1.+ 20.31,50.81 18.5,49 14,49 12.75,47.75 D22.A 12.75,42.75 R37.1 13,37.5 14,36.5 14,25 U$2.C
  Bottom 1.27: U$2.C U$1.2
  Bottom 2.54: B1.+ 21.19,73.62 C126.+ | C126.+ C1.+ | C9.1 20.04,75.46 20.31,75.19 C126.+
VIN+2
  Top 1.016: R50.1 85.5,50.5 85.5,54.5 83.5,56.5 C45.+
  Top 1.27: C45.+ 75.81,50.81 74,49 69.5,49 68.25,47.75 D18.A 68.25,42.75 R23.1 68.5,37.5 69.5,36.5 69.5,25 U$14.C
  Bottom 1.27: U$14.C U$13.2
  Bottom 2.54: B5.+ 76.69,73.62 C40.+ | C40.+ C45.+ | C49.1 75.54,75.46 75.81,75.19 C40.+
VIN-
  Top 1.016: R39.2 52.5,42.75 D23.C | R3.2 37.5,56.5 C2.-
  Top 1.27: R39.2 52.5,48 44.19,56.31 C2.- | D23.C 52.75,39.75 50,37 50,25 U$4.C
  Bottom 1.27: U$4.C U$3.2
  Bottom 2.54: B2.- 37.88,56.5 C2.- C128.- 44.19,84.73 C10.2
VIN-2
  Top 1.016: R25.2 108,42.75 D19.C | R49.2 93,56.5 C46.-
  Top 1.27: R25.2 108,48 99.69,56.31 C46.- | D19.C 108.25,39.75 105.5,37 105.5,25 U$16.C
  Bottom 1.27: U$16.C U$15.2
  Bottom 2.54: B6.- 93.38,56.5 C46.- C41.- 99.69,84.73 C50.2

### Text on the board
tPlace: AC-IN | AC-IN | 1k | 10k | 1k | 10k | 10k | 10k | 1k | 1k | 10 | 10 | 150 | 10 | 10 | 150 | 150 | 47u | 47u | 150 | 47u | 47u | 10 | 10 | 10 | 10 | RG | RG | RP | RP | LT1021 | LT1021 | 47u | 47u | RP | RP | RN | RN | 500 | 500